# Altium project smart_oven.PrjPCB
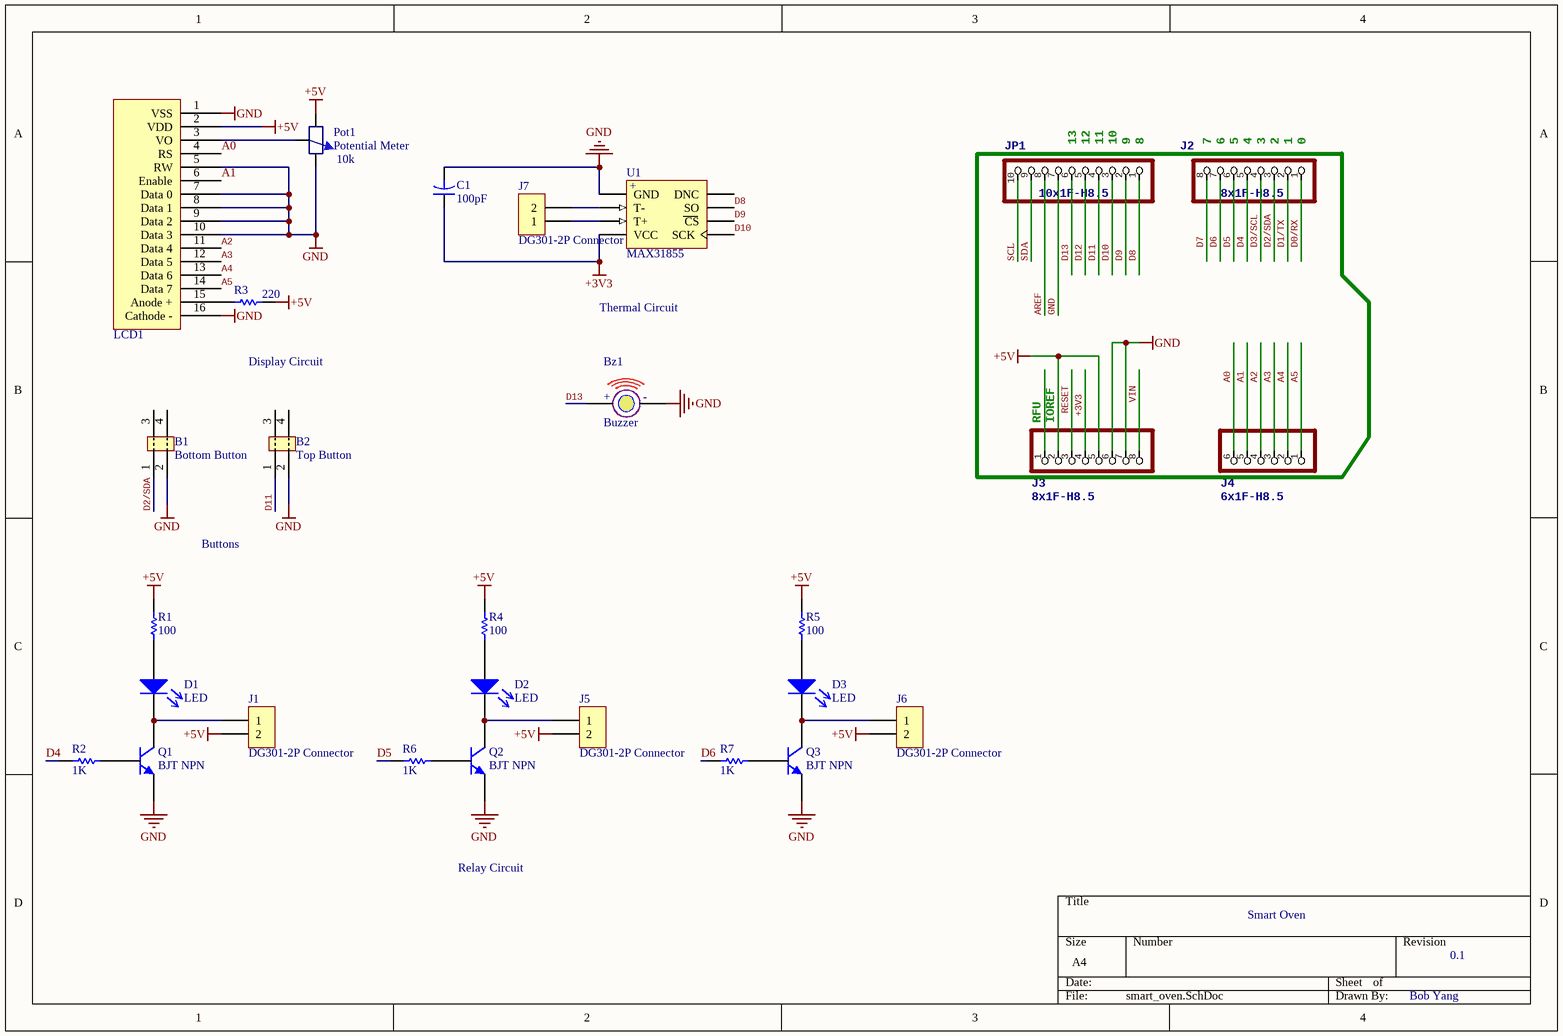
[diagram p0: smart_oven.SchDoc]
1 sheet, 28 parts. Net scope: global (net labels, ports and power ports of the same name join across sheets).
Board file: smart_oven.PcbDoc

## Sheet smart_oven.SchDoc
size A4

### Parts
B1  Bottom Button  [push button]
B2  Top Button  [push button]
Bz1  Buzzer  [Buzzer]
C1  value 100pF  [CAPR5-4X5]  (hidden comment: Cap2)
D1  LED  [LED TOP92]
D2  LED  [LED TOP92]
D3  LED  [LED TOP92]
J1  DG301-2P Connector  [DG301-2P Connector]
J2  8x1F-H8.5  [PINHD-1X8]
J3  8x1F-H8.5  [PINHD-1X8]
J4  6x1F-H8.5  [PINHD-1X6]
J5  DG301-2P Connector  [DG301-2P Connector]
J6  DG301-2P Connector  [DG301-2P Connector]
J7  DG301-2P Connector  [DG301-2P Connector]
JP1  10x1F-H8.5  [PINHD-1X10]
LCD1  LCD1602  [LCD1602]  (value not drawn)
Pot1  Potential Meter  value 10k  [Axial ThrimPot]
Q1  BJT NPN  [BJT TOP92]
Q2  BJT NPN  [BJT TOP92]
Q3  BJT NPN  [BJT TOP92]
R1  value 100  [AXIAL-0.3]  (hidden comment: Res1)
R2  value 1K  [AXIAL-0.3]  (hidden comment: Res1)
R3  value 220  [AXIAL-0.3]  (hidden comment: Res1)
R4  value 100  [AXIAL-0.3]  (hidden comment: Res1)
R5  value 100  [AXIAL-0.3]  (hidden comment: Res1)
R6  value 1K  [AXIAL-0.3]  (hidden comment: Res1)
R7  value 1K  [AXIAL-0.3]  (hidden comment: Res1)
U1  MAX31855  [SOP8 Breakout]

### Nets
+3V3: C1.1 J3.4 U1.4(VCC)
+5V: J1.2 J3.2 J3.5 J5.2 J6.2 LCD1.2(VDD) Pot1.1 R1.2 R3.2 R4.2 R5.2
GND: B1.2 B2.2 Bz1.2(-) C1.2 J3.6 J3.7 JP1.7 LCD1.1(VSS) LCD1.5(RW) LCD1.7(Data_0) LCD1.8(Data_1) LCD1.9(Data_2) LCD1.10(Data_3) LCD1.16(Cathode_-) Pot1.2 Q1.e Q2.e Q3.e U1.1(GND)
A0: J4.6 LCD1.4(RS)
A1: J4.5 LCD1.6(Enable)
A2: J4.4 LCD1.11(Data_4)
A3: J4.3 LCD1.12(Data_5)
A4: J4.2 LCD1.13(Data_6)
A5: J4.1 LCD1.14(Data_7)
AREF: JP1.8
D0/RX: J2.1
D1/TX: J2.2
D2/SDA: B1.1 J2.3
D3/SCL: J2.4
D4: J2.5 R2.2
D5: J2.6 R6.2
D6: J2.7 R7.2
D7: J2.8
D8: JP1.1 U1.7(SO)
D9: JP1.2 U1.6(CS)
D10: JP1.3 U1.5(SCK)
D11: B2.1 JP1.4
D12: JP1.5
D13: Bz1.1(+) JP1.6
RESET: J3.3
SCL: JP1.10
SDA: JP1.9
VIN: J3.8
NetD1_1: D1.1 R1.1
NetD1_2: D1.2 J1.1 Q1.c
NetD2_1: D2.1 R4.1
NetD2_2: D2.2 J5.1 Q2.c
NetD3_1: D3.1 R5.1
NetD3_2: D3.2 J6.1 Q3.c
NetJ7_1: J7.1 U1.3(T+)
NetJ7_2: J7.2 U1.2(T-)
NetLCD1_3: LCD1.3(VO) Pot1.3
NetLCD1_15: LCD1.15(Anode_+) R3.1
NetQ1_b: Q1.b R2.1
NetQ2_b: Q2.b R6.1
NetQ3_b: Q3.b R7.1

Not connected (* = marked no-connect by the designer): B1 3 4; B2 3 4; J3 1; U1 8(DNC)

### Notes on the sheet
- (near JP1) 13
- (near JP1) 12
- (near JP1) 11
- (near JP1) 10
- (near JP1) 9
- (near JP1) 8
- (near J2) 7
- (near J2) 6
- (near J2) 5
- (near J2) 4
- (near J2) 3
- (near J2) 2
- (near J2) 1
- (near J2) 0
- Thermal Circuit
- Display Circuit
- (near J3) RFU
- (near J3) IOREF
- Buttons
- Relay Circuit
- Smart Oven
- 0.1
- Bob Yang
- (in symbol MAX31855) +

### Library data of the parts
B1 B2 = Push Button
Bz1 = Buzzer: Piezo Buzzer
C1 = Cap2: Capacitor; Published: 23-Sep-2002; PackageReference: CAPR5-4X5; Publisher: Altium Limited; PackageDescription: Capacitor; 2 Leads
D1-D3 = LED: pin to pad: 1>P 2>N
J2 J3 = PINHD-1X8: PIN HEADER
J4 = PINHD-1X6: PIN HEADER
JP1 = PINHD-1X10: PIN HEADER
LCD1 = LCD1602: LCD 1602
Q1-Q3 = BJT NPN: value: S9013
R1-R7 = Res1: Resistor; Published: 8-Jun-2000; LatestRevisionDate: 17-Jul-2002; LatestRevisionNote: Re-released for DXP Platform.; PackageReference: AXIAL-0.3; Publisher: Altium Limited; PackageDescription: Axial Device, Thru-Hole; 2 Leads; 0.3 in Pin Spacing
U1 = MAX31855: K thermal-couple reading IC